# EAGLE design LineIn (EAGLE 6.5.0)
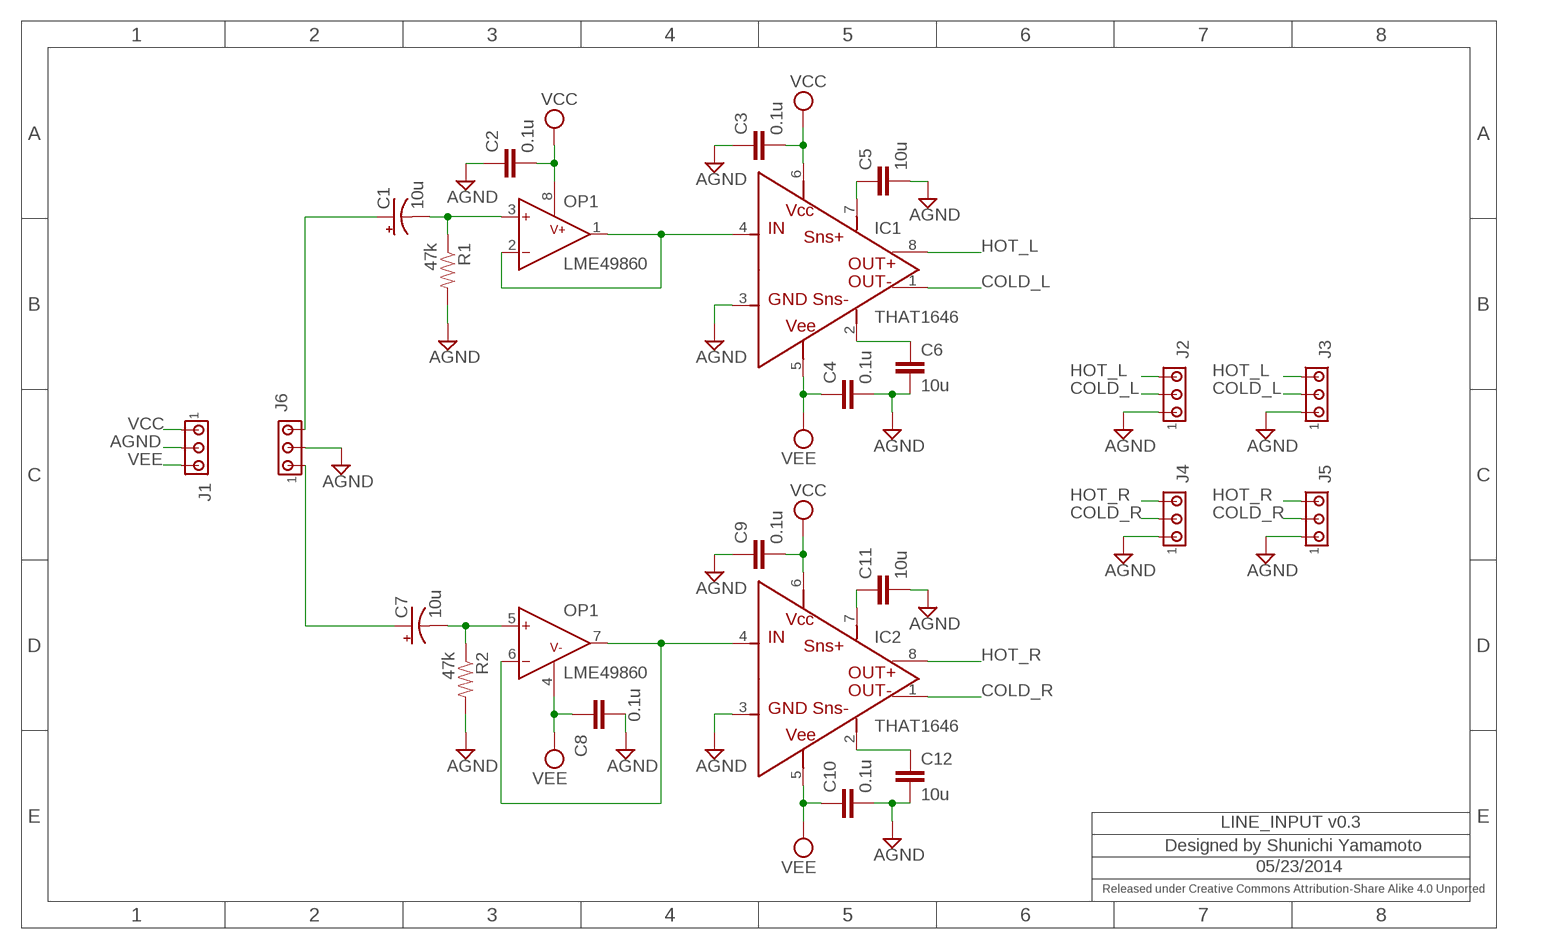
[diagram p0: schematic, sheet 1]

## Parts
C1  10u  CPOL-USUD-5X5,8  [UD-5X5,8_NICHICON]
C2  0.1u  C-EUC2012  [C2012]
C3  0.1u  C-EUC2012  [C2012]
C4  0.1u  C-EUC2012  [C2012]
C5  10u  C-EUC2012  [C2012]
C6  10u  C-EUC2012  [C2012]
C7  10u  CPOL-USUD-5X5,8  [UD-5X5,8_NICHICON]
C8  0.1u  C-EUC2012  [C2012]
C9  0.1u  C-EUC2012  [C2012]
C10  0.1u  C-EUC2012  [C2012]
C11  10u  C-EUC2012  [C2012]
C12  10u  C-EUC2012  [C2012]
IC1  THAT1646  [SOIC8]
IC2  THAT1646  [SOIC8]
J1  MTA03-156  [1X3MTA]
J2  MTA03-100  [10X03MTA]
J3  MTA03-100  [10X03MTA]
J4  MTA03-100  [10X03MTA]
J5  MTA03-100  [10X03MTA]
J6  MTA03-100  [10X03MTA]
OP1  LME49860  [SOIC8@1]
R1  47k  RESISTOR0805-RES  [0805]
R2  47k  RESISTOR0805-RES  [0805]

## Nets
AGND: C2.1 C3.1 C4.2 C5.2 C6.2 C8.2 C9.1 C10.2 C11.2 C12.2 IC1.3(GND) IC2.3(GND) J1.2 J2.1 J3.1 J4.1 J5.1 J6.2 R1.2 R2.2
COLD_L: IC1.1(OUT-) J2.2 J3.2
COLD_R: IC2.1(OUT-) J4.2 J5.2
HOT_L: IC1.8(OUT+) J2.3 J3.3
HOT_R: IC2.8(OUT+) J4.3 J5.3
LIN_L: IC1.4(IN) OP1.1(OUTA) OP1.2(INA-)
LIN_R: IC2.4(IN) OP1.6(INB-) OP1.7(OUTB)
N$1: C1.+ J6.3
N$2: C1.- OP1.3(INA+) R1.1
N$3: C7.+ J6.1
N$4: C5.1 IC1.7(SNS+)
N$5: C7.- OP1.5(INB+) R2.1
N$6: C11.1 IC2.7(SNS+)
N$7: C6.1 IC1.2(SNS-)
N$8: C12.1 IC2.2(SNS-)
VCC: C2.2 C3.2 C9.2 IC1.6(VCC) IC2.6(VCC) J1.1 OP1.8(V+)
VEE: C4.1 C8.1 C10.1 IC1.5(VEE) IC2.5(VEE) J1.3 OP1.4(V-)

## Notes on the sheet
- LINE_INPUT v0.3
- Designed by Shunichi Yamamoto
- 05/23/2014
- Released under Creative Commons Attribution-Share Alike 4.0 Unported

## Library data of the parts
C1 C7 = rcl:CPOL-US: POLARIZED CAPACITOR, American symbol
C2-C6 C8-C12 = rcl:C-EU: CAPACITOR, European symbol
IC1 IC2 = thatcorp:THAT1646
J1 = con-amp:MTA03-156: AMP connector
J2-J6 = con-amp:MTA03-100: AMP connector
OP1 = thatcorp:LME49860
R1 R2 = SparkFun:RESISTOR: Resistor Basic schematic elements and footprints for 0603, 1206, and PTH resistors.

## Board
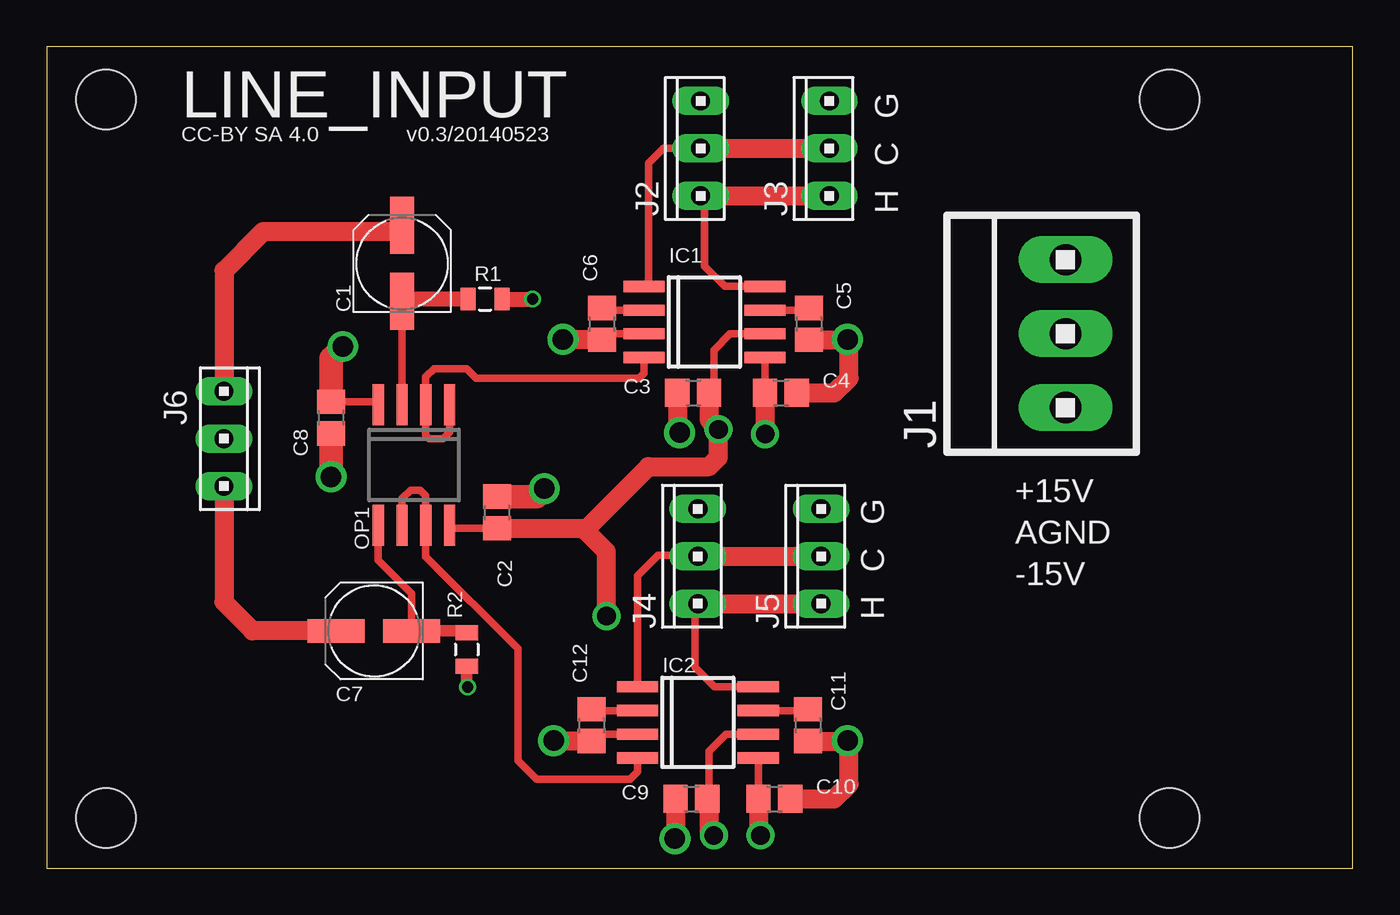
[diagram p1: board, top side]
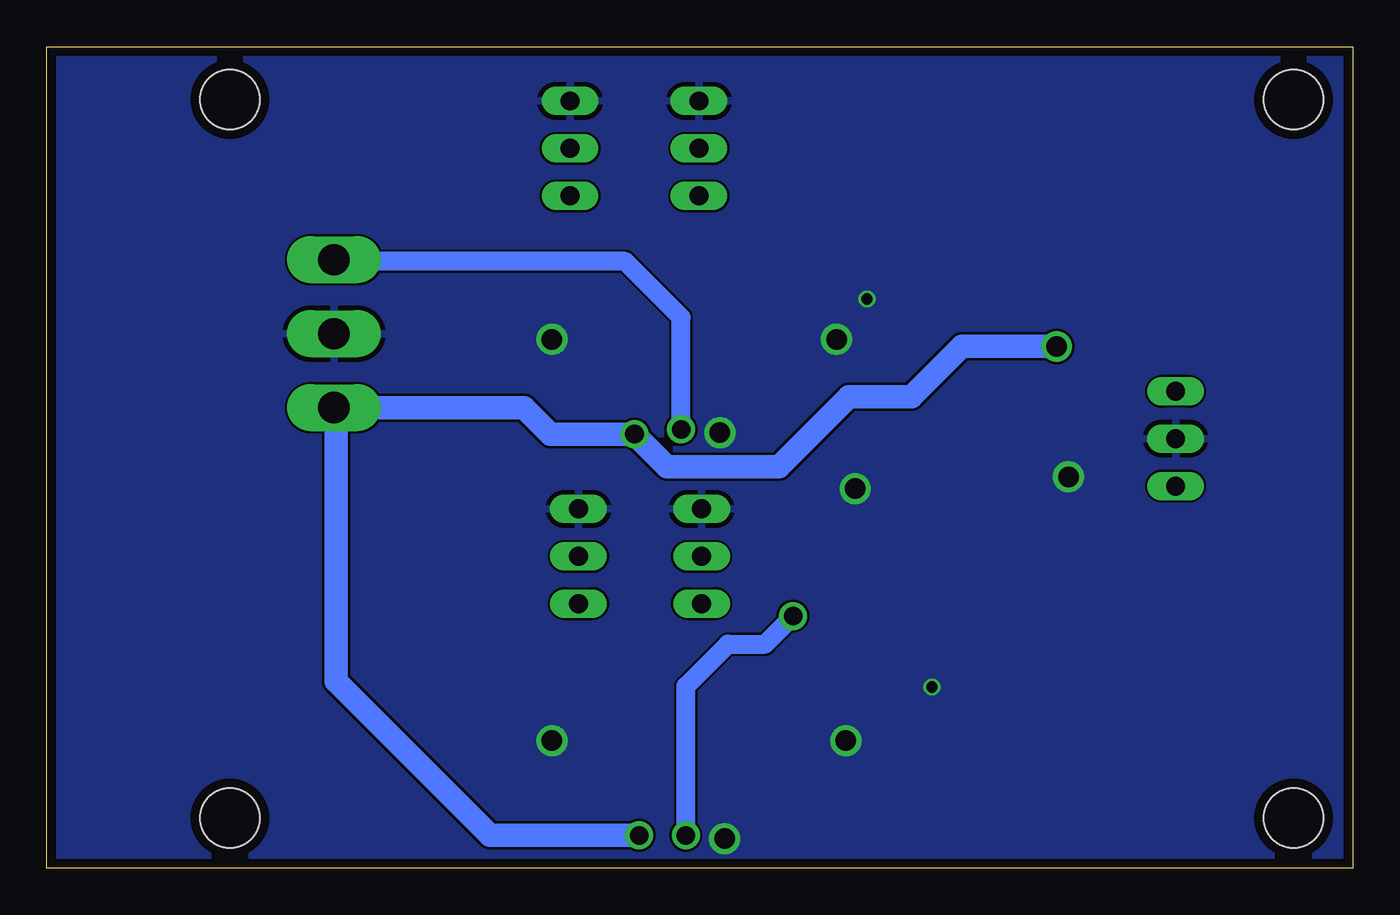
[diagram p2: board, bottom side, seen from below]

Size 70 x 44 mm. Coordinates in mm from the lower left corner, seen from the top.
Outline: 0,0 70,0 70,44 0,44 0,0
Copper layers (1*16): Top 0.035mm / dielectric 1.53mm / Bottom 0.035mm
Design rules "pban_5mil-l2": minimum track width 5mil, minimum drill 0.3mm, track to track 5mil, track to pad 0.229mm, pad to pad 5mil, via to via 5mil, smd to smd 5mil, copper to edge 0.5mm, drill to drill 0.5mm, minimum pad ring 0.15mm, minimum via ring 0.15mm, stop-mask expansion 4mil, vias tented up to drill 0.35mm, thermal gap 10mil
Holes 3.2 mm at 60.17,41.17 3.17,41.17 3.17,2.67 60.17,2.67

### Footprints (pad centres in the part's own frame; a part is rotated, then mirrored left to right if it is on the bottom)
UD-5X5,8_NICHICON = smd 3.048 x 1.27: + 2.042,0; - -2.018,0
C2012 = smd 1.3 x 1.5: 1 -0.85,0; 2 0.85,0
SOIC8 = smd 0.6 x 2.2: 1 -1.905,-3.235; 2 -0.635,-3.235; 3 0.635,-3.235; 4 1.905,-3.235; 5 1.905,3.235; 6 0.635,3.235; 7 -0.635,3.235; 8 -1.905,3.235
1X3MTA = drill 1.676 long: 1 3.937,0; 2 -0.025,0; 3 -3.988,0
10X03MTA = drill 1.016 long: 1 2.54,0; 2 0,0; 3 -2.54,0
SOIC8@1 = smd 0.6 x 2.2: 1 -1.905,-3.235; 2 -0.635,-3.235; 3 0.635,-3.235; 4 1.905,-3.235; 5 1.905,3.235; 6 0.635,3.235; 7 -0.635,3.235; 8 -1.905,3.235
0805 = smd 0.8 x 1.2: 1 -0.9,0; 2 0.9,0

### Placement (x,y rotation side)
C1  19.05,32.38 90 top
C2  24.13,19.05 270 top
C3  34.65,25.45 0 top
C4  39.35,25.45 0 top
C5  40.85,29.15 270 top
C6  29.75,29.15 270 top
C7  17.55,12.7 180 top
C8  15.24,24.13 270 top
C9  34.55,3.7 0 top
C10  39,3.7 0 top
C11  40.8,7.65 270 top
C12  29.2,7.65 270 top
IC1  35.25,29.25 270 top
IC2  34.9,7.8 270 top
J1  54.6,28.65 90 top
J2  35.05,38.55 90 top
J3  41.95,38.55 90 top
J4  34.9,16.7 90 top
J5  41.5,16.7 90 top
J6  9.5,23 270 top
OP1  19.68,21.59 180 top
R1  23.5,30.48 0 top
R2  22.52,11.7 270 top

### Tracks (layer width: path | path; a pad name or v marks a point on that pad's centre or on a via)
AGND  (via drill 0.6, 1.1)
  Top 0.406: IC1.3 30.07,28.61 C6.2 | IC2.3 29.57,7.17 C12.2 | 22.52,9.74 v22.55,9.7
  Top 0.61: R2.2 22.52,9.74
  Top 0.813: R1.2 v26.04,30.48
  Top 1.016: C6.2 27.69,28.3 v27.67,28.32 | C5.2 42.9,28.3 v42.92,28.32 43,28.24 43,26.25 42.2,25.45 C4.2 | C12.2 27.19,6.8 v27.17,6.82 | C11.2 42.9,6.8 v42.92,6.82 43,6.74 43,4.5 42.2,3.7 C10.2 | C3.1 33.8,23.44 v33.92,23.32 | C9.1 33.7,1.6 v33.67,1.57
  Top 1.27: C8.2 v15.24,20.95 | C2.1 26.25,19.9 v26.67,20.32
  pour Bottom: -0.32,43.81 -0.32,-0.32 70.04,-0.32 70.04,43.81
COLD_L
  Top 0.406: J2.2 33.05,38.55 32.25,37.75 32.25,31.39 IC1.1
  Top 1.016: J2.2 J3.2
COLD_R
  Top 0.406: IC2.1 31.66,15.66 32.75,16.75 34.85,16.75 J4.2
  Top 1.016: J4.2 J5.2
HOT_L
  Top 0.406: IC1.8 36.34,31.16 35.25,32.25 35.25,35.81 J2.3
  Top 1.016: J2.3 J3.3
HOT_R
  Top 0.406: IC2.8 35.8,9.71 34.75,10.75 34.75,14.01 J4.3
  Top 1.016: J4.3 J5.3
LIN_L
  Top 0.406: IC1.4 32.02,26.52 31.75,26.25 23,26.25 22.5,26.75 20.75,26.75 20.32,26.32 OP1.2 20.32,23.18 20.5,23 21.25,23 21.59,23.34 OP1.1
LIN_R
  Top 0.406: IC2.4 31.66,5.17 31.25,4.75 26.25,4.75 25.25,5.75 25.25,11.75 20.32,16.68 OP1.7 20.32,19.93 20,20.25 19.5,20.25 19.05,19.8 OP1.6
N$1
  Top 1.016: C1.+ 18.73,34.11 11.61,34.11 9.5,32 J6.3
N$2
  Top 0.406: C1.- OP1.3
  Top 0.813: R1.1 19.2,30.48 C1.-
N$3
  Top 1.016: C7.+ 11.04,12.7 9.5,14.24 J6.1
N$4
  Top 0.406: IC1.7 40.73,29.89 C5.1
N$5
  Top 0.406: C7.- 19.57,14.68 17.75,16.5 17.75,18.32 OP1.5 | 22.41,12.7 R2.1
  Top 0.61: C7.- 22.41,12.7
N$6
  Top 0.406: IC2.7 40.73,8.44 C11.1
N$7
  Top 0.406: IC1.2 29.75,29.89 C6.1
N$8
  Top 0.406: IC2.2 29.27,8.44 C12.1
VCC  (via drill 1)
  Top 0.406: C2.2 21.75,18.2 OP1.8 | IC1.6 36.62,28.61 35.75,27.75 35.75,25.7 C3.2 | IC2.6 36.41,7.17 35.5,6.25 35.5,3.8 C9.2
  Top 1.016: C3.2 35.5,24 v36,23.5 36,22 35.5,21.5 32.25,21.5 28.95,18.2 28.75,18.2 | C2.2 28.75,18.2 | 35.5,3.8 35.5,2 v35.75,1.75 | v30,13.5 30,16.95 28.75,18.2
  Bottom 1.016: v36,23.5 36,29.5 39,32.5 54.51,32.5 J1.1 | v35.75,1.75 35.75,9.75 33.5,12 31.5,12 v30,13.5
VEE  (via drill 1, 1.1)
  Top 0.406: C8.1 17.62,24.98 OP1.4 | C4.1 38.5,27.33 IC1.5 | 38.15,5.88 IC2.5 38.13,3.71 C10.1
  Top 1.016: C4.1 v38.5,23.25 | C10.1 38.15,1.85 v38.25,1.75
  Top 1.27: C8.1 15.24,27.3 v15.88,27.94
  Bottom 1.27: v15.88,27.94 20.95,27.94 23.64,25.25 27,25.25 30.75,21.5 36.75,21.5 v38.5,23.25 43,23.25 44.41,24.66 J1.3 54.5,24.56 54.5,10 46.25,1.75 v38.25,1.75

### Text on the board
tNames: LINE_INPUT | G | CC-BY SA 4.0 | v0.3/20140523 | C | H | +15V | G | AGND | C | -15V | H